# EAGLE design Switch Boosterpack (EAGLE 6.3)
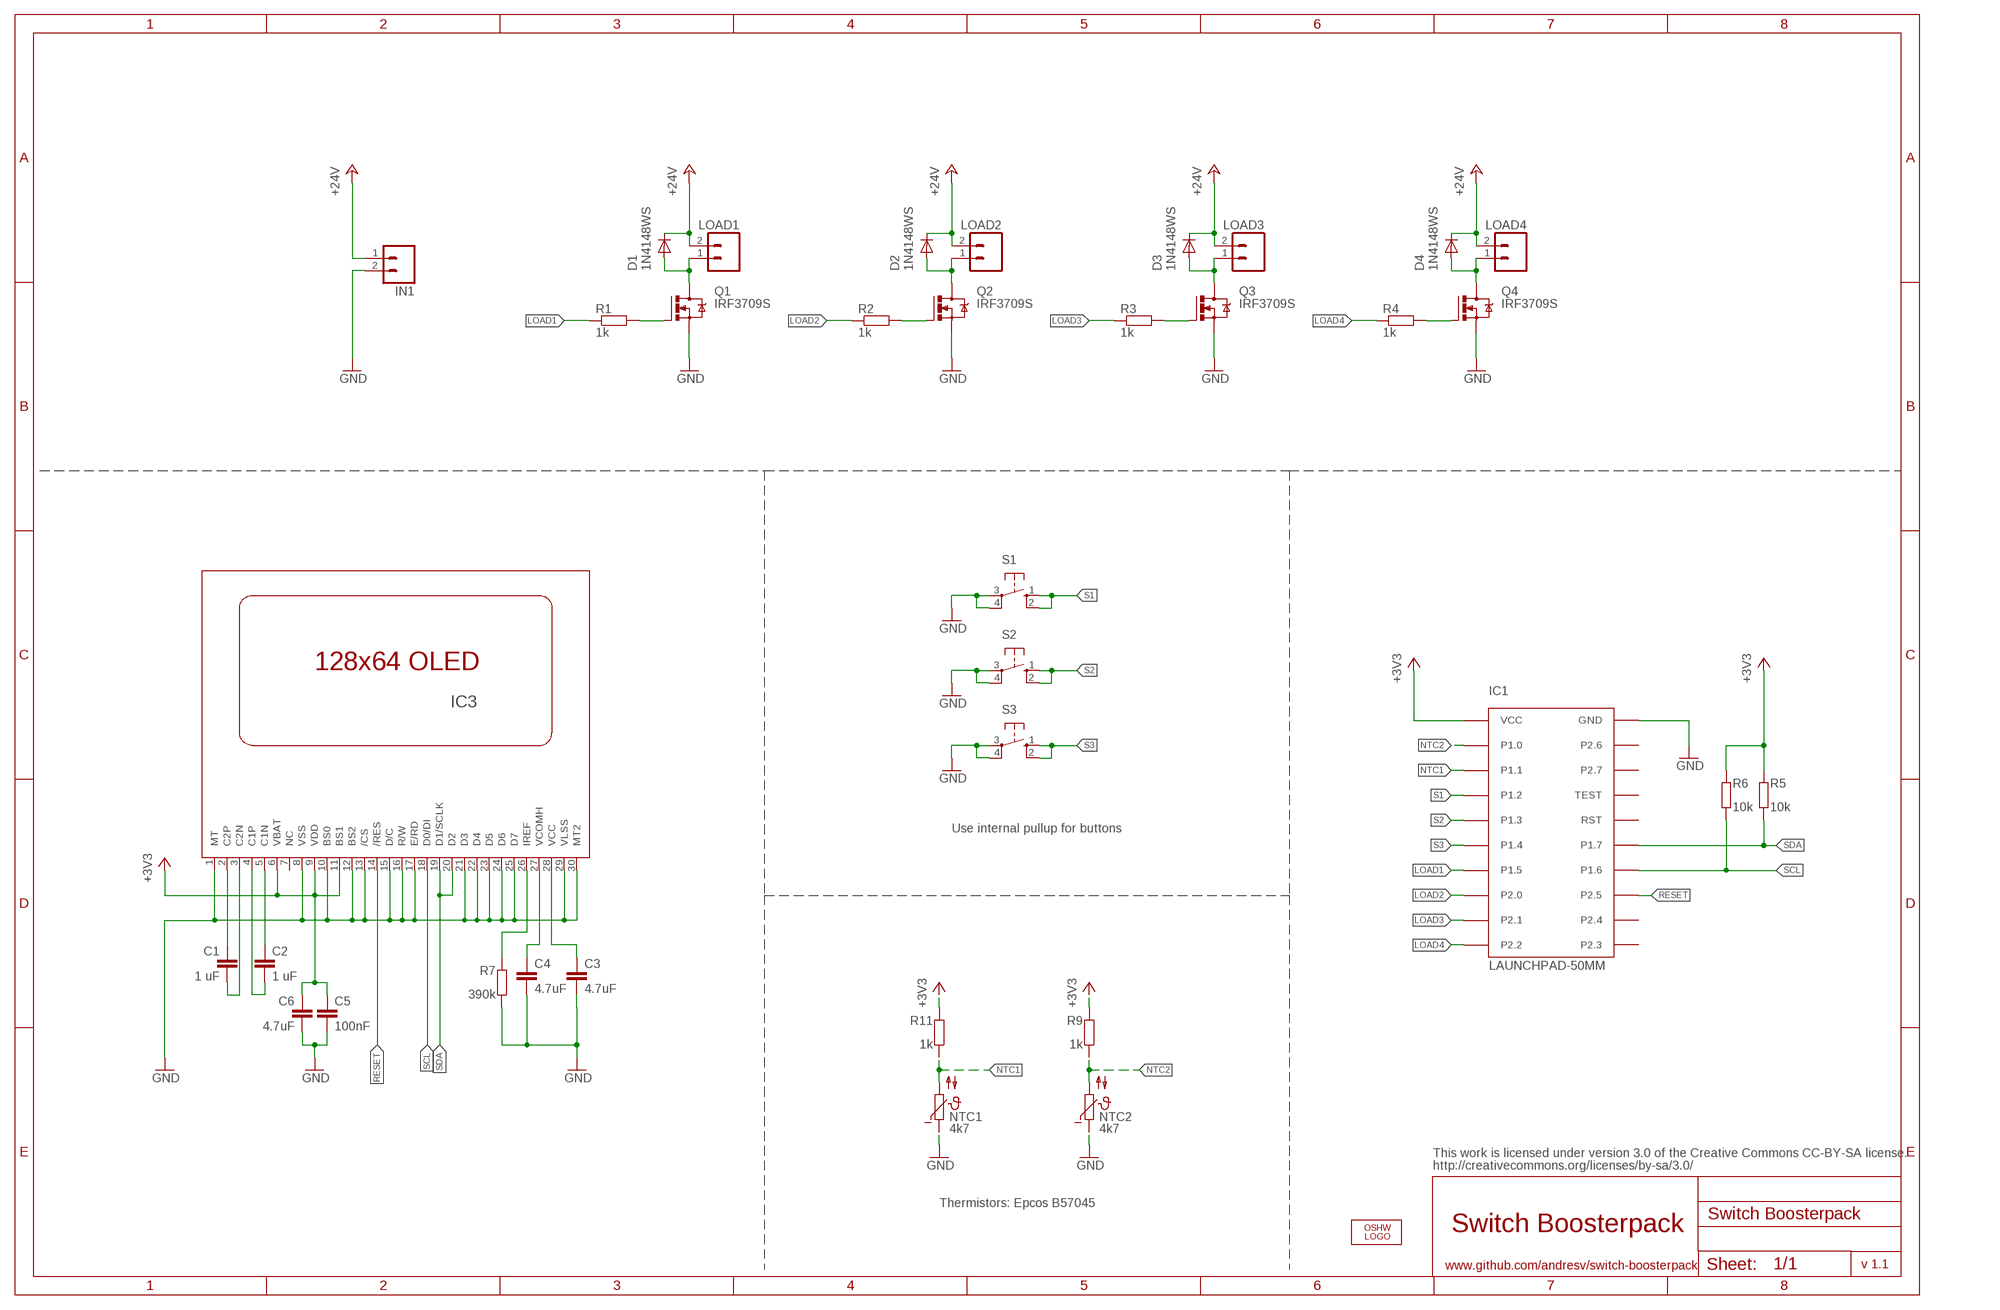
[diagram p0: schematic, sheet 1]

## Parts
C1  1 uF  C-EUC0603  [C0603]
C2  1 uF  C-EUC0603  [C0603]
C3  4.7uF  C-EUC0603  [C0603]
C4  4.7uF  C-EUC0603  [C0603]
C5  100nF  C-EUC0603  [C0603]
C6  4.7uF  C-EUC0603  [C0603]
D1  1N4148WS  DIODE-SOD323-W  [SOD323-W]
D2  1N4148WS  DIODE-SOD323-W  [SOD323-W]
D3  1N4148WS  DIODE-SOD323-W  [SOD323-W]
D4  1N4148WS  DIODE-SOD323-W  [SOD323-W]
IC1  LAUNCHPAD-50MM  [LAUNCHPAD-50MM]
IC3  UG-2864HSWEG01  [1X30-0.7MM]
IN1  M025MM  [SCREWTERMINAL-5MM-2]
LOAD1  M025MM  [SCREWTERMINAL-5MM-2]
LOAD2  M025MM  [SCREWTERMINAL-5MM-2]
LOAD3  M025MM  [SCREWTERMINAL-5MM-2]
LOAD4  M025MM  [SCREWTERMINAL-5MM-2]
LOGO1  OSHW_LOGO_8MILX0350-NT  [OSHW_8X350_NOTEXT]
NTC1  4k7  NTC640-9  [N640]
NTC2  4k7  NTC640-9  [N640]
Q1  IRF3709S  IRFR3709  [D-PAK_TO252AA]
Q2  IRF3709S  IRFR3709  [D-PAK_TO252AA]
Q3  IRF3709S  IRFR3709  [D-PAK_TO252AA]
Q4  IRF3709S  IRFR3709  [D-PAK_TO252AA]
R1  1k  R-EU_R0603  [R0603]
R2  1k  R-EU_R0603  [R0603]
R3  1k  R-EU_R0603  [R0603]
R4  1k  R-EU_R0603  [R0603]
R5  10k  R-EU_R0603  [R0603]
R6  10k  R-EU_R0603  [R0603]
R7  390k  R-EU_R0603  [R0603]
R9  1k  R-EU_R0603  [R0603]
R11  1k  R-EU_R0603  [R0603]
S1  10-XX  [B3F-10XX]
S2  10-XX  [B3F-10XX]
S3  10-XX  [B3F-10XX]

## Nets
+3V3: C5.1 C6.1 IC1.VCC IC3.6(VBAT) IC3.9(VDD) IC3.11(BS1) R5.2 R6.2 R9.2 R11.2
+24V: D1.C D2.C D3.C D4.C IN1.1 LOAD1.2 LOAD2.2 LOAD3.2 LOAD4.2
GND: C3.2 C4.2 C5.2 C6.2 IC1.GND IC3.1(MT) IC3.8(VSS) IC3.10(BS0) IC3.12(BS2) IC3.13(/CS) IC3.15(D/C) IC3.16(R/W) IC3.17(E/RD) IC3.21(D3) IC3.22(D4) IC3.23(D5) IC3.24(D6) IC3.25(D7) IC3.29(VLSS) IC3.30(MT2) IN1.2 NTC1.1 NTC2.1 Q1.3(S) Q2.3(S) Q3.3(S) Q4.3(S) R7.1 S1.3(P) S1.4(P1) S2.3(P) S2.4(P1) S3.3(P) S3.4(P1)
LOAD1: IC1.P1.5 R1.1
LOAD2: IC1.P2.0 R2.1
LOAD3: IC1.P2.1 R3.1
LOAD4: IC1.P2.2 R4.1
N$1: D1.A LOAD1.1 Q1.4(D)
N$2: Q1.1(G) R1.2
N$3: D2.A LOAD2.1 Q2.4(D)
N$4: Q2.1(G) R2.2
N$5: D3.A LOAD3.1 Q3.4(D)
N$6: Q3.1(G) R3.2
N$7: D4.A LOAD4.1 Q4.4(D)
N$8: Q4.1(G) R4.2
N$9: C1.1 IC3.2(C2P)
N$10: C1.2 IC3.3(C2N)
N$11: C2.1 IC3.5(C1N)
N$12: C2.2 IC3.4(C1P)
N$13: C3.1 IC3.28(VCC)
N$14: C4.1 IC3.27(VCOMH)
N$15: IC3.26(IREF) R7.2
NTC1: IC1.P1.1 NTC1.2 R11.1
NTC2: IC1.P1.0 NTC2.2 R9.1
RESET: IC1.P2.5 IC3.14(/RES)
S1: IC1.P1.2 S1.1(S) S1.2(S1)
S2: IC1.P1.3 S2.1(S) S2.2(S1)
S3: IC1.P1.4 S3.1(S) S3.2(S1)
SCL: IC1.P1.6 IC3.18(D0/DI) R6.1
SDA: IC1.P1.7 IC3.19(D1/SCLK) IC3.20(D2) R5.1
Unconnected: IC1.P2.3 IC1.P2.4 IC1.P2.6 IC1.P2.7 IC1.RST IC1.TEST IC3.7(NC)

## Notes on the sheet
- Use internal pullup for buttons
- This work is licensed under version 3.0 of the Creative Commons CC-BY-SA license.
- http://creativecommons.org/licenses/by-sa/3.0/
- Thermistors: Epcos B57045
- Switch Boosterpack
- www.github.com/andresv/switch-boosterpack | v 1.1

## Library data of the parts
C1-C6 = rcl:C-EU: CAPACITOR, European symbol
D1-D4 = diode:DIODE-: DIODE
IC1 = TI_launchpad:LAUNCHPAD: MSP-EXP430G2 LaunchPad Booster Pack layouts. LAUNCHPAD: Full-size board LAUNCHPAD-50MM: 50x50mm board covering the button area LAUNCHPAD-50MM-LEFT: 50x50mm board leaving the button area open. Tall LaunchPad components marked on Reference for reference.
IC3 = oled:UG-2864HSWEG01: UG-2864HSWEG01 OLED display
IN1 LOAD1-LOAD4 = SparkFun:M02: Header 2 Standard 2-pin 0.1" header. Use with straight break away headers (SKU : PRT-00116), right angle break away headers (PRT-00553), swiss pins (PRT-00743), machine pins (PRT-00117), and female headers (PRT-00115). Molex polarized connector foot print use with SKU : PRT-08233 with associated crimp pins and housings.
LOGO1 = OSHW:OSHW_LOGO_8MIL
NTC1 NTC2 = ptc-ntc:NTC640-9: PHILIPS NTC; OC_FARNELL: unknown; OC_NEWARK: unknown
Q1-Q4 = mosfet:IRFR3709: N-Channel HEXFET® Power MOSFET Logic Level POWER MOSFET Source: http://www.irf.com/product-info/datasheets/data/irf3709.pdf
R1-R7 R9 R11 = rcl:R-EU_: RESISTOR, European symbol
S1-S3 = switch-omron:10-XX: OMRON SWITCH; MPN: B3F-1000; OC_FARNELL: 176432; OC_NEWARK: 36M3542

## Board
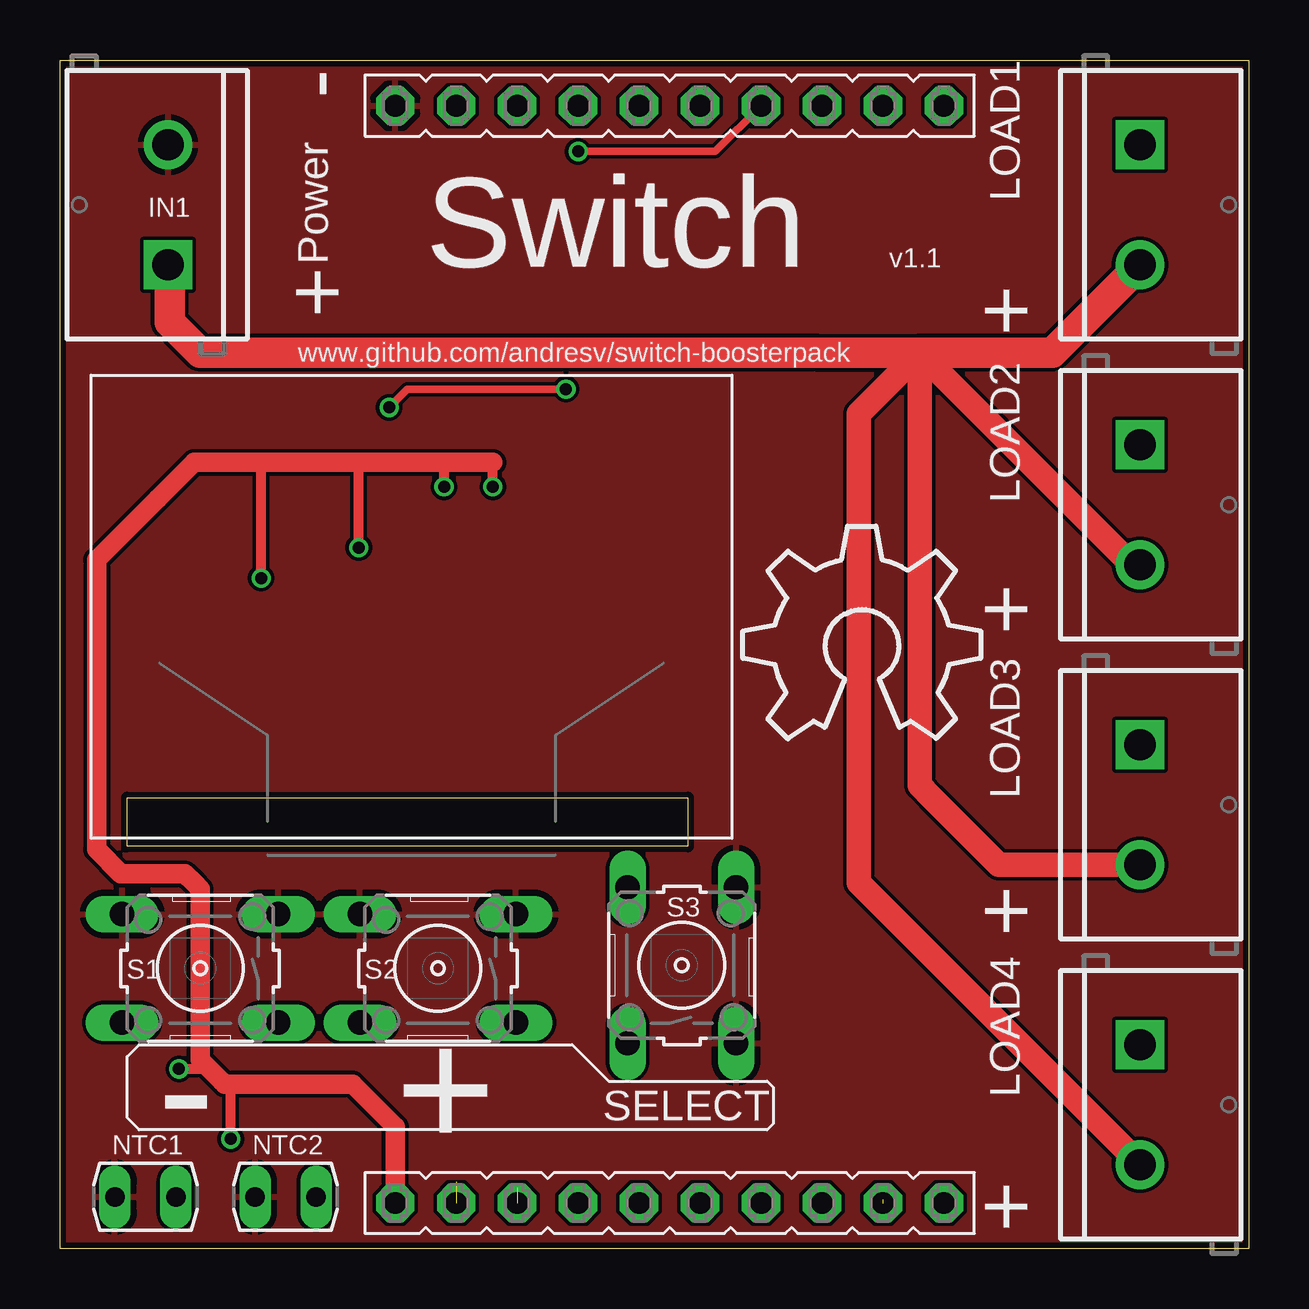
[diagram p1: board, top side]
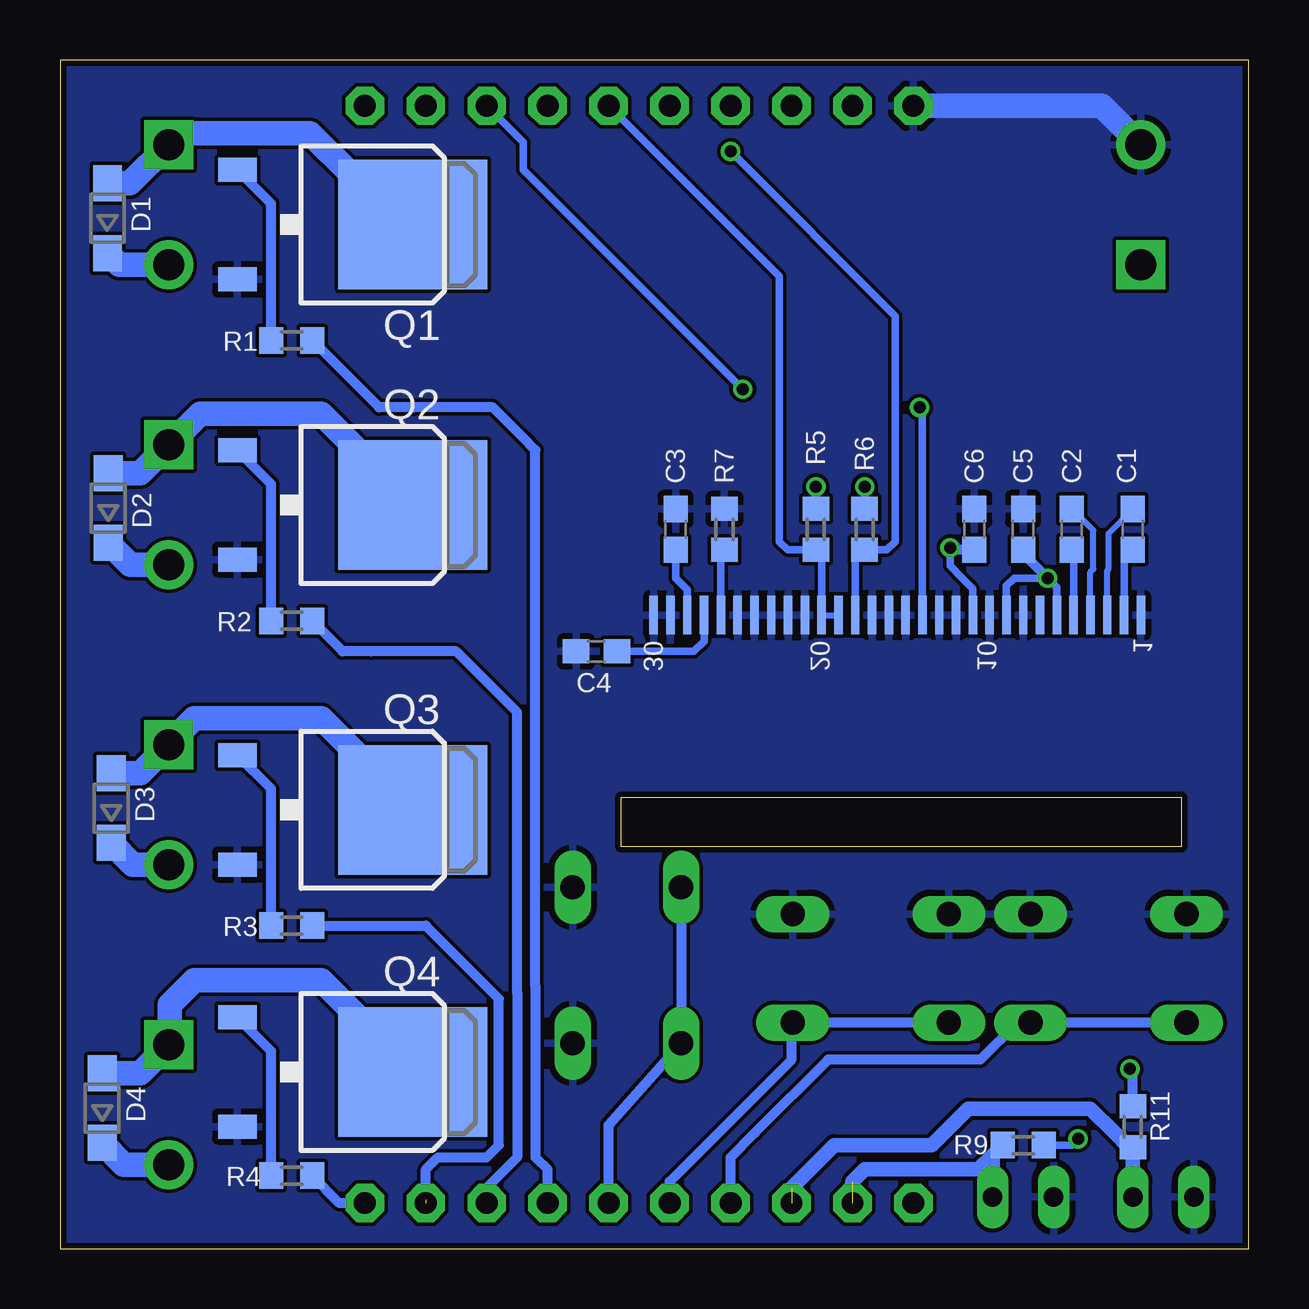
[diagram p2: board, bottom side, seen from below]

Size 49.53 x 49.53 mm. Coordinates in mm from the lower left corner, seen from the top.
Outline: 2.79,16.76 2.79,18.8 26.16,18.8 26.16,16.76 2.79,16.76
Copper layers (1*16): Top 0.035mm / dielectric 1.5mm / Bottom 0.035mm
Design rules "default": minimum track width 6mil, minimum drill 12mil, track to track 6mil, track to pad 6mil, pad to pad 6mil, via to via 6mil, smd to smd 0mil, copper to edge 10mil, drill to drill 10mil, minimum pad ring 10mil, minimum via ring 6mil, stop-mask expansion 2mil, vias tented up to drill 100mil, thermal gap 10mil

### Footprints (pad centres in the part's own frame; a part is rotated, then mirrored left to right if it is on the bottom)
C0603 = smd 1.1 x 1: 1 -0.85,0; 2 0.85,0
SOD323-W = smd 1.5 x 1.2: A 1.45,0; C -1.45,0
LAUNCHPAD-50MM = drill 0.914 pad 1.6 octagon: GND 13.97,48.26; P1.0 16.51,2.54; P1.1 19.05,2.54; P1.2 21.59,2.54; P1.3 24.13,2.54; P1.4 26.67,2.54; P1.5 29.21,2.54; P1.6 29.21,48.26; P1.7 26.67,48.26; P2.0 31.75,2.54; P2.1 34.29,2.54; P2.2 36.83,2.54; P2.3 36.83,48.26; P2.4 34.29,48.26; P2.5 31.75,48.26; P2.6 16.51,48.26; P2.7 19.05,48.26; RST 24.13,48.26; TEST 21.59,48.26; VCC 13.97,2.54
1X30-0.7MM = smd 0.35 x 1.6 bottom: 1 -10.15,0; 2 -9.45,0; 3 -8.75,0; 4 -8.05,0; 5 -7.35,0; 6 -6.65,0; 7 -5.95,0; 8 -5.25,0; 9 -4.55,0; 10 -3.85,0; 11 -3.15,0; 12 -2.45,0; 13 -1.75,0; 14 -1.05,0; 15 -0.35,0; 16 0.35,0; 17 1.05,0; 18 1.75,0; 19 2.45,0; 20 3.15,0; 21 3.85,0; 22 4.55,0; 23 5.25,0; 24 5.95,0; 25 6.65,0; 26 7.35,0; 27 8.05,0; 28 8.75,0; 29 9.45,0; 30 10.15,0
SCREWTERMINAL-5MM-2 = drill 1.3 pad 2.032 square: 1 0,0 | drill 1.3 pad 2.032: 2 5,0
N640 = drill 0.813 long: 1 -1.27,0; 2 1.27,0
D-PAK_TO252AA = smd 1 x 1.6: 1 -2.28,-4.8; 3 2.28,-4.8 | smd 5.4 x 6.2: 4 0,2.5
R0603 = smd 1 x 1.1: 1 -0.85,0; 2 0.85,0
B3F-10XX = drill 1.016 long: 1 -3.251,2.261; 2 3.251,2.261; 3 -3.251,-2.261; 4 3.251,-2.261

### Placement (x,y rotation side)
C1  4.83,29.97 90 bottom
C2  7.37,29.97 90 bottom
C3  23.88,29.97 90 bottom
C4  27.18,24.89 180 bottom
C5  9.4,29.97 90 bottom
C6  11.43,29.97 90 bottom
D1  47.55,42.94 90 bottom
D2  47.52,30.86 90 bottom
D3  47.4,18.36 90 bottom
D4  47.77,5.86 90 bottom
IC1  0,-0.64 0 top
IC3  14.64,26.4 0 top
IN1  4.5,41 90 top
LOAD1  45,46 270 top
LOAD2  45,33.5 270 top
LOAD3  45,21 270 top
LOAD4  45,8.5 270 top
LOGO1  28.45,21.24 0 top
NTC1  3.56,2.16 0 top
NTC2  9.4,2.16 0 top
Q1  37.34,42.67 270 bottom
Q2  37.34,30.99 270 bottom
Q3  37.34,18.29 270 bottom
Q4  37.34,7.37 270 bottom
R1  39.88,37.85 180 bottom
R2  39.88,26.16 180 bottom
R3  39.88,13.46 180 bottom
R4  39.88,3.05 180 bottom
R5  18.03,29.97 90 bottom
R6  16,29.97 90 bottom
R7  21.84,29.97 270 bottom
R9  9.4,4.32 0 bottom
R11  4.83,5.08 90 bottom
S1  5.84,11.68 180 top
S2  15.75,11.68 180 top
S3  25.91,11.81 90 top

### Tracks (layer width: path | path; a pad name or v marks a point on that pad's centre or on a via)
+3V3  (via drill 0.5)
  Top 0.305: 7.11,6.6 6.73,6.99
  Top 0.406: v16,31.75 16,32.77 | v18.03,31.75 18.03,32.77 | v7.11,4.57 7.11,6.6 | v4.95,7.49 6.35,7.49 6.73,6.99 | v12.45,29.21 12.45,32.77 | v8.38,27.94 8.38,32.77
  Top 0.813: IC1.VCC 13.97,5.08 12.19,6.86 6.86,6.86 6.73,6.99 5.84,7.87 5.84,14.22 5.84,14.99 5.59,15.24 5.21,15.62 2.54,15.62 1.52,16.64 1.52,28.7 4.06,31.24 5.59,32.77 8.38,32.77 10.41,32.77 12.45,32.77 15.75,32.77 16,32.77 18.03,32.77
  Bottom 0.305: R6.2 v16,31.75 | R5.2 v18.03,31.75 | R9.2 7.37,4.32 v7.11,4.57 | C5.1 9.49,29.12 | IC3.11 11.49,27.5 11.94,27.94 12.45,28.45 v12.45,29.21 | IC3.6 7.99,27.55 v8.38,27.94 9.78,27.94 10.09,27.63 IC3.9 | 9.49,28.87 9.31,28.87
  Bottom 0.406: R11.2 4.83,7.37 v4.95,7.49 | C6.1 12.36,29.12 v12.45,29.21 | 9.49,29.12 9.49,28.87 | 9.31,28.87 v8.38,27.94
+24V
  Top 1.016: LOAD3.2 40.64,16 39.12,16 36.32,18.8 35.81,19.3 35.81,37.34 | LOAD2.2 44.65,28.5 35.81,37.34 | 35.81,37.34 33.27,34.8 33.27,15.24 37.34,11.18 45,3.51 LOAD4.2
  Top 1.27: LOAD1.2 41.34,37.34 35.81,37.34 31.5,37.34 5.84,37.34 4.57,38.61 4.57,40.93 IN1.1
  Bottom 1.016: LOAD1.2 47.07,41 D1.C | LOAD2.2 46.61,28.5 D2.C | LOAD3.2 46.49,16 D3.C | LOAD4.2 46.87,3.5 D4.C
GND
  Bottom 1.016: IC1.GND 6.12,47.62 IN1.2
  pour Bottom: 0,0 0,49.53 49.53,49.53 49.53,0
  pour Top: 0,0 0,49.53 49.53,49.53 49.53,0
LOAD1
  Bottom 0.406: R1.1 36.23,35.05 34.8,35.05 31.5,35.05 30.23,33.78 29.72,33.27 29.72,10.92 29.72,3.81 29.21,3.3 IC1.P1.5
LOAD2
  Bottom 0.406: IC1.P2.0 31.75,2.54 30.48,3.81 30.48,10.67 30.48,22.35 30.99,22.86 33.02,24.89 36.58,24.89 37.76,24.89 R2.1
LOAD3  (1 unrouted)
  Bottom 0.406: 34.29,2.03 34.29,3.3 33.78,3.81 31.75,3.81 31.24,4.32 31.24,10.41 34.29,13.46 R3.1
LOAD4
  Bottom 0.406: IC1.P2.2 37.88,1.91 R4.1
N$1
  Bottom 1.016: D1.A 46.61,44.39 LOAD1.1 44.96,45.96 44.96,45.97 44.45,46.48 39.12,46.48 37.34,44.7 36.87,44.7 Q1.4
N$2
  Bottom 0.406: R1.2 40.73,43.54 Q1.1
N$3
  Bottom 1.016: D2.A 46.19,32.31 LOAD2.1 44.96,33.46 44.96,33.53 43.69,34.8 38.65,34.8 Q2.4
N$4
  Bottom 0.406: R2.2 40.73,31.86 Q2.1
N$5
  Bottom 1.016: D3.A 46.19,19.81 LOAD3.1 44.96,20.96 44.96,21.08 44.2,21.84 43.94,22.1 38.65,22.1 Q3.4
N$6
  Bottom 0.406: R3.2 40.73,19.16 Q3.1
N$7
  Bottom 1.016: D4.A 46.19,7.31 LOAD4.1 44.96,8.46 44.96,10.16 43.94,11.18 38.65,11.18 Q4.4
N$8
  Bottom 0.406: R4.2 40.73,8.24 Q4.1
N$9
  Bottom 0.305: IC3.2 5.19,29.01 C1.1
N$10
  Bottom 0.254: IC3.3 5.89,28.27 5.84,28.32 5.84,29.81 C1.2
N$11
  Bottom 0.305: IC3.5 7.29,29.05 C2.1
N$12
  Bottom 0.254: IC3.4 6.59,28.2 6.48,28.32 6.48,29.93 C2.2
N$13
  Bottom 0.305: IC3.28 23.39,27.46 23.88,27.94 C3.1
N$14
  Bottom 0.305: IC3.27 22.69,25.31 23.11,24.89 25.4,24.89 C4.1
N$15
  Bottom 0.305: IC3.26 21.99,28.97 R7.2
NTC1  (1 unrouted)
  Bottom 0.61: 19.05,2.54 17.27,4.32 13.21,4.32 11.68,5.84 6.86,5.84 6.6,5.84 5.59,4.83 4.99,4.23 R11.1 NTC1.2
NTC2  (1 unrouted)
  Bottom 0.61: NTC2.2 10.67,3.9 | 10.67,3.9 R9.1 | 16.51,2.79 16,3.3 12.19,3.3 11.26,3.3 10.67,3.9
RESET  (via drill 0.5)
  Top 0.305: v21.08,35.81 14.48,35.81 v13.72,35.05
  Bottom 0.305: IC3.14 13.59,34.93 v13.72,35.05 | v21.08,35.81 30.23,44.96 30.23,46.1 IC1.P2.5
S1
  Bottom 0.406: IC1.P1.2 21.59,3.81 20.57,4.83 17.53,7.87 11.18,7.87 9.63,9.42 S1.1 S1.2
S2
  Bottom 0.406: IC1.P1.3 24.13,2.79 19.05,7.87 19.05,9.37 S2.1 S2.2
S3
  Bottom 0.406: IC1.P1.4 26.67,5.16 S3.1 S3.2
SCL  (via drill 0.5)
  Top 0.305: v21.59,45.72 27.3,45.72 IC1.P1.6
  Bottom 0.305: v21.59,45.72 14.73,38.86 14.73,30.48 14.73,29.46 15.07,29.12 R6.1 16.39,28.73 IC3.18
SDA
  Bottom 0.254: IC3.20 IC3.19
  Bottom 0.305: IC1.P1.7 19.56,40.51 19.56,30.73 19.56,29.46 19.22,29.12 R5.1 17.79,28.88 IC3.20

### Text on the board
tNames: - | + | Power | Switch | v1.1 | + | www.github.com/andresv/switch-boosterpack | + | + | SELECT | - | + | +